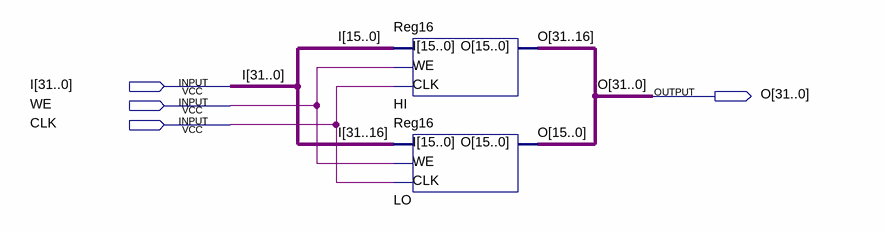
[diagram p0: schematic sheet]
// Quartus schematic Reg32.bdf as structural Verilog: 2 symbols, 4 pins
module Reg32 (
  input  [31:0] I,
  input  WE,
  input  CLK,
  output [31:0] O
);

  Reg16 HI (.WE(WE), .CLK(CLK), .I(I[15:0]), .O(O[31:16]));
  Reg16 LO (.WE(WE), .CLK(CLK), .I(I[31:16]), .O(O[15:0]));
endmodule
